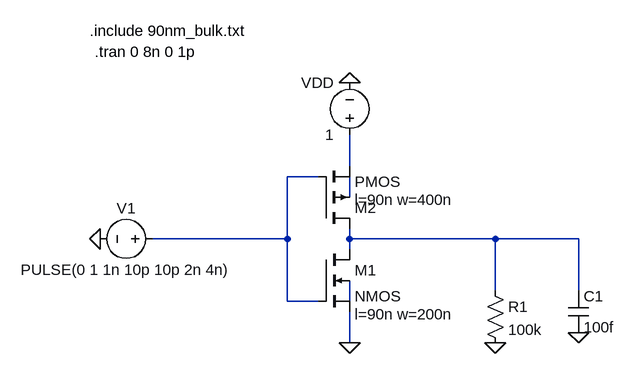
[diagram p0: schematic invertor.asc]
invertor.asc, the LTspice schematic file:
Version 4
SHEET 1 880 680
WIRE 32 144 32 96
WIRE -16 160 -64 160
WIRE 32 192 32 160
WIRE -64 256 -64 160
WIRE -64 256 -272 256
WIRE 32 256 32 240
WIRE 256 256 32 256
WIRE 384 256 256 256
WIRE 32 272 32 256
WIRE 256 336 256 256
WIRE 384 336 384 256
WIRE -64 352 -64 256
WIRE -16 352 -64 352
WIRE 32 352 32 320
WIRE 32 416 32 368
FLAG 32 416 0
FLAG 256 416 0
FLAG 384 400 0
FLAG -352 256 0
FLAG 32 16 0
SYMBOL nmos4 -16 272 R0
WINDOW 123 56 100 Left 2
SYMATTR InstName M1
SYMATTR Value2 l=90n w=200n
SYMBOL pmos4 -16 240 M180
WINDOW 123 56 44 Left 2
SYMATTR InstName M2
SYMATTR Value2 l=90n w=400n
SYMBOL res 240 320 R0
SYMATTR InstName R1
SYMATTR Value 100k
SYMBOL cap 368 336 R0
SYMATTR InstName C1
SYMATTR Value 100f
SYMBOL voltage -256 256 R90
WINDOW 0 -32 56 VBottom 2
WINDOW 3 32 56 VTop 2
WINDOW 123 0 0 Left 0
WINDOW 39 0 0 Left 0
SYMATTR InstName V1
SYMATTR Value PULSE(0 1 1n 10p 10p 2n 4n)
SYMBOL voltage 32 112 R180
WINDOW 0 24 96 Left 2
WINDOW 3 24 16 Left 2
WINDOW 123 0 0 Left 0
WINDOW 39 0 0 Left 0
SYMATTR InstName VDD
SYMATTR Value 1
TEXT -368 -64 Left 2 !.include 90nm_bulk.txt
TEXT -360 -32 Left 2 !.tran 0 8n 0 1p

The netlist it stands for:
* invertor.asc
M1 N004 N002 0 N005 NMOS l=90n w=200n
M2 N004 N002 N001 N003 PMOS l=90n w=400n
R1 N004 0 100k
C1 N004 0 100f
V1 N002 0 PULSE(0 1 1n 10p 10p 2n 4n)
VDD N001 0 1
.model NMOS NMOS
.model PMOS PMOS
.lib standard.mos
.include 90nm_bulk.txt
.tran 0 8n 0 1p
.backanno
.end